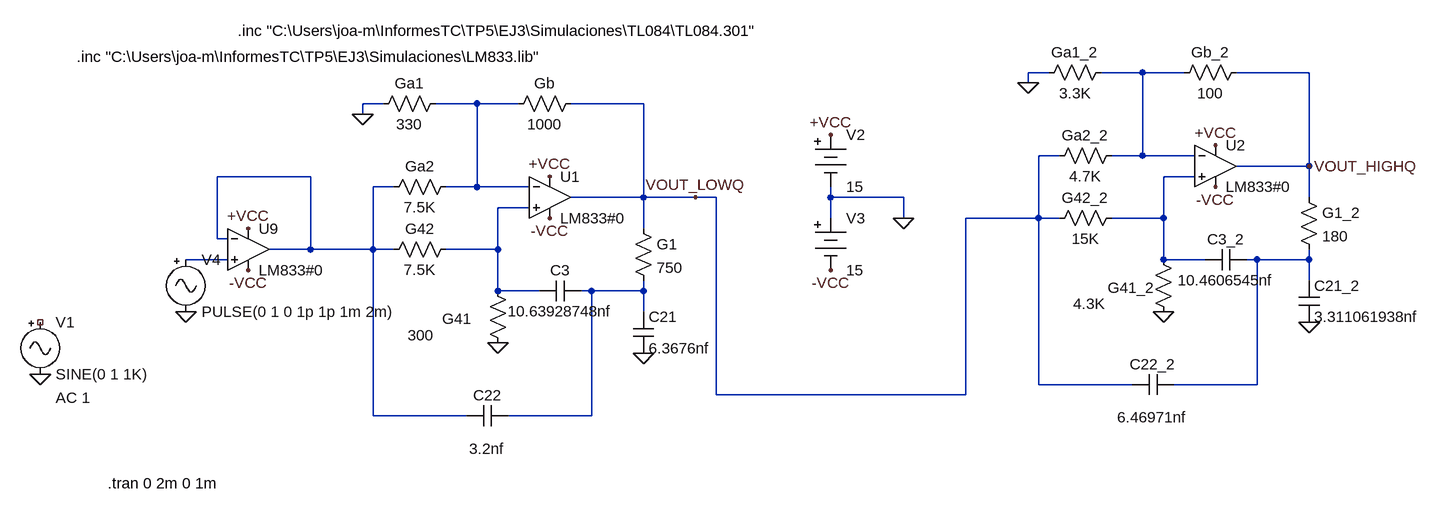
[diagram p0: schematic rtaescalon.asc]
rtaescalon.asc, the LTspice schematic file:
Version 4
SHEET 1 3008 2004
WIRE 1168 -48 1136 -48
WIRE 1312 -48 1248 -48
WIRE 1376 -48 1312 -48
WIRE 1568 -48 1456 -48
WIRE 1136 -32 1136 -48
WIRE 144 0 112 0
WIRE 288 0 224 0
WIRE 352 0 288 0
WIRE 544 0 432 0
WIRE 112 16 112 0
WIRE 1184 80 1152 80
WIRE 1312 80 1312 -48
WIRE 1312 80 1264 80
WIRE 1392 80 1312 80
WIRE 1568 96 1568 -48
WIRE 1568 96 1456 96
WIRE 32 112 -112 112
WIRE 1392 112 1344 112
WIRE 160 128 128 128
WIRE 288 128 288 0
WIRE 288 128 240 128
WIRE 368 128 288 128
WIRE 544 144 544 0
WIRE 544 144 432 144
WIRE 624 144 544 144
WIRE 656 144 624 144
WIRE 832 144 832 128
WIRE 944 144 832 144
WIRE 1568 144 1568 96
WIRE 368 160 320 160
WIRE 832 176 832 144
WIRE 944 176 944 144
WIRE 1152 176 1152 80
WIRE 1152 176 1040 176
WIRE 1184 176 1152 176
WIRE 1344 176 1344 112
WIRE 1344 176 1264 176
WIRE 544 192 544 144
WIRE -112 208 -112 112
WIRE -96 208 -112 208
WIRE 32 224 32 112
WIRE 32 224 -32 224
WIRE 128 224 128 128
WIRE 128 224 32 224
WIRE 160 224 128 224
WIRE 320 224 320 160
WIRE 320 224 240 224
WIRE -96 240 -160 240
WIRE 1344 240 1344 176
WIRE 1408 240 1344 240
WIRE 1488 240 1472 240
WIRE 1568 240 1568 224
WIRE 1568 240 1488 240
WIRE 1568 272 1568 240
WIRE 320 288 320 224
WIRE 384 288 320 288
WIRE 464 288 448 288
WIRE 544 288 544 272
WIRE 544 288 464 288
WIRE 544 320 544 288
WIRE 1152 432 1152 176
WIRE 1296 432 1152 432
WIRE 1488 432 1488 240
WIRE 1488 432 1360 432
WIRE 656 448 656 144
WIRE 1040 448 1040 176
WIRE 1040 448 656 448
WIRE 128 480 128 224
WIRE 272 480 128 480
WIRE 464 480 464 288
WIRE 464 480 336 480
FLAG 112 16 0
FLAG 544 384 0
FLAG 320 368 0
FLAG -384 416 0
FLAG 944 176 0
FLAG 400 112 +VCC
FLAG 832 48 +VCC
FLAG 400 176 -VCC
FLAG 832 256 -VCC
FLAG 1136 -32 0
FLAG 1568 336 0
FLAG 1344 320 0
FLAG 1424 64 +VCC
FLAG 1424 128 -VCC
FLAG 1568 96 VOUT_HIGHQ
FLAG 624 144 VOUT_LOWQ
FLAG -64 192 +VCC
FLAG -64 256 -VCC
FLAG -160 320 0
SYMBOL Opamps\\opamp2 400 80 R0
SYMATTR InstName U1
SYMATTR Value LM833#0
SYMATTR SpiceModel LM833#0
SYMBOL res 128 16 R270
WINDOW 0 32 56 VTop 2
WINDOW 3 0 56 VBottom 2
SYMATTR InstName Ga1
SYMATTR Value 330
SYMBOL res 336 16 R270
WINDOW 0 32 56 VTop 2
WINDOW 3 0 56 VBottom 2
SYMATTR InstName Gb
SYMATTR Value 1000
SYMBOL res 304 272 R0
WINDOW 0 -70 59 Left 2
WINDOW 3 -123 84 Left 2
SYMATTR InstName G41
SYMATTR Value 300
SYMBOL res 528 176 R0
SYMATTR InstName G1
SYMATTR Value 750
SYMBOL cap 448 272 R90
WINDOW 0 0 32 VBottom 2
WINDOW 3 32 32 VTop 2
SYMATTR InstName C3
SYMATTR Value 10.63928748nf
SYMBOL cap 336 464 R90
WINDOW 0 0 32 VBottom 2
WINDOW 3 51 33 VTop 2
SYMATTR InstName C22
SYMATTR Value 3.2nf
SYMBOL cap 528 320 R0
SYMATTR InstName C21
SYMATTR Value 6.3676nf
SYMBOL Misc\\signal -384 320 R0
WINDOW 123 24 132 Left 2
WINDOW 39 0 0 Left 0
SYMATTR Value2 AC 1
SYMATTR InstName V1
SYMBOL Misc\\battery 832 32 R0
WINDOW 123 0 0 Left 0
WINDOW 39 0 0 Left 0
SYMATTR InstName V2
SYMATTR Value 15
SYMBOL Misc\\battery 832 160 R0
WINDOW 123 0 0 Left 0
WINDOW 39 0 0 Left 0
SYMATTR InstName V3
SYMATTR Value 15
SYMBOL res 256 112 R90
WINDOW 0 0 56 VBottom 2
WINDOW 3 32 56 VTop 2
SYMATTR InstName Ga2
SYMATTR Value 7.5K
SYMBOL res 256 208 R90
WINDOW 0 0 56 VBottom 2
WINDOW 3 32 56 VTop 2
SYMATTR InstName G42
SYMATTR Value 7.5K
SYMBOL Opamps\\opamp2 1424 32 R0
SYMATTR InstName U2
SYMATTR Value LM833#0
SYMATTR SpiceModel LM833#0
SYMBOL res 1152 -32 R270
WINDOW 0 32 56 VTop 2
WINDOW 3 0 56 VBottom 2
SYMATTR InstName Ga1_2
SYMATTR Value 3.3K
SYMBOL res 1360 -32 R270
WINDOW 0 32 56 VTop 2
WINDOW 3 0 56 VBottom 2
SYMATTR InstName Gb_2
SYMATTR Value 100
SYMBOL res 1328 224 R0
WINDOW 0 -70 59 Left 2
WINDOW 3 -123 84 Left 2
SYMATTR InstName G41_2
SYMATTR Value 4.3K
SYMBOL res 1552 128 R0
SYMATTR InstName G1_2
SYMATTR Value 180
SYMBOL cap 1472 224 R90
WINDOW 0 0 32 VBottom 2
WINDOW 3 32 32 VTop 2
SYMATTR InstName C3_2
SYMATTR Value 10.4606545nf
SYMBOL cap 1360 416 R90
WINDOW 0 0 32 VBottom 2
WINDOW 3 51 33 VTop 2
SYMATTR InstName C22_2
SYMATTR Value 6.46971nf
SYMBOL cap 1552 272 R0
SYMATTR InstName C21_2
SYMATTR Value 3.311061938nf
SYMBOL res 1280 64 R90
WINDOW 0 0 56 VBottom 2
WINDOW 3 32 56 VTop 2
SYMATTR InstName Ga2_2
SYMATTR Value 4.7K
SYMBOL res 1280 160 R90
WINDOW 0 0 56 VBottom 2
WINDOW 3 32 56 VTop 2
SYMATTR InstName G42_2
SYMATTR Value 15K
SYMBOL Opamps\\opamp2 -64 160 R0
SYMATTR InstName U9
SYMATTR Value LM833#0
SYMATTR Value2 LM833#0
SYMBOL Misc\\signal -160 224 R0
WINDOW 123 0 0 Left 0
WINDOW 39 0 0 Left 0
SYMATTR InstName V4
SYMATTR Value PULSE(0 1 0 1p 1p 1m 2m)
TEXT -80 -112 Left 2 !.inc "C:\\Users\\joa-m\\InformesTC\\TP5\\EJ3\\Simulaciones\\TL084\\TL084.301"
TEXT -328 -72 Left 2 !.inc "C:\\Users\\joa-m\\InformesTC\\TP5\\EJ3\\Simulaciones\\LM833.lib"
TEXT -280 584 Left 2 !.tran 0 2m 0 1m

The netlist it stands for:
* rtaescalon.asc
XU1 N005 N002 +VCC -VCC VOUT_LOWQ LM833#0 LM833#0  ; pins In+ In- V+ V- OUT
R§Ga1 0 N002 330
R§Gb N002 VOUT_LOWQ 1000
R§G41 N005 0 300
R§G1 VOUT_LOWQ N008 750
C3 N008 N005 10.63928748nf
C22 N008 N003 3.2nf
C21 N008 0 6.3676nf
V1 NC_01 0 SINE(0 1 1K) AC 1
V2 +VCC 0 15
V3 0 -VCC 15
R§Ga2 N002 N003 7.5K
R§G42 N005 N003 7.5K
XU2 N004 N001 +VCC -VCC VOUT_HIGHQ LM833#0 LM833#0  ; pins In+ In- V+ V- OUT
R§Ga1_2 0 N001 3.3K
R§Gb_2 N001 VOUT_HIGHQ 100
R§G41_2 N004 0 4.3K
R§G1_2 VOUT_HIGHQ N007 180
C3_2 N007 N004 10.4606545nf
C22_2 N007 VOUT_LOWQ 6.46971nf
C21_2 N007 0 3.311061938nf
R§Ga2_2 N001 VOUT_LOWQ 4.7K
R§G42_2 N004 VOUT_LOWQ 15K
XU9 N006 N003 +VCC -VCC N003 LM833#0 LM833#0  ; pins In+ In- V+ V- OUT
V4 N006 0 PULSE(0 1 0 1p 1p 1m 2m)
.inc "C:\Users\joa-m\InformesTC\TP5\EJ3\Simulaciones\TL084\TL084.301"
.inc "C:\Users\joa-m\InformesTC\TP5\EJ3\Simulaciones\LM833.lib"
.tran 0 2m 0 1m
.backanno
.end